# Altium schematic sheet power.SchDoc: schematic template
size 420 x 297 mm; Date: 2021-12-08; Author: Joachim Löfwander; Revision: ABC-123; SheetNumber: 2; SheetTotal: 4; Website: jlofw.com
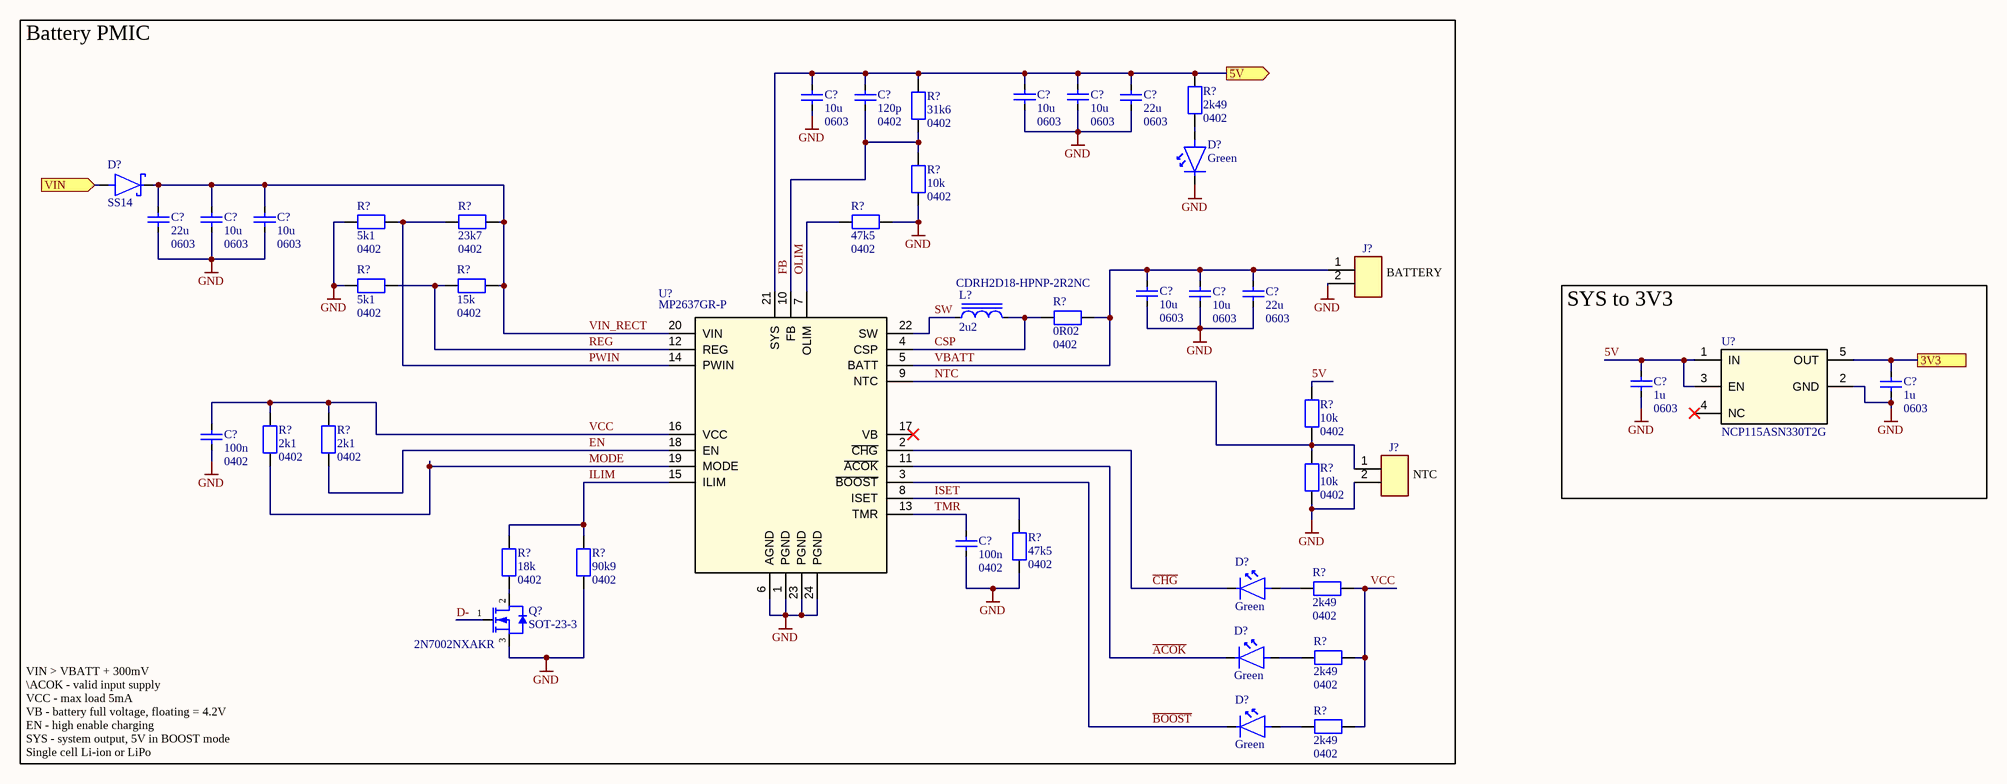
[diagram p0: power.SchDoc]

## Parts
(Parts that share a designator on the sheet are numbered #1, #2 ... from top to bottom, then left to right.)
C?#1  value 10u  Package: 0603  [C_0603_1608Metric_IPCB]  (hidden comment: Capacitor_Ceramic)
C?#2  value 120p  Package: 0402  [C_0402_1005Metric_IPCB]  (hidden comment: Capacitor_Ceramic)
C?#3  value 10u  Package: 0603  [C_0603_1608Metric_IPCB]  (hidden comment: Capacitor_Ceramic)
C?#4  value 10u  Package: 0603  [C_0603_1608Metric_IPCB]  (hidden comment: Capacitor_Ceramic)
C?#5  value 22u  Package: 0603  [C_0603_1608Metric_IPCB]  (hidden comment: Capacitor_Ceramic)
C?#6  value 22u  Package: 0603  [C_0603_1608Metric_IPCB]  (hidden comment: Capacitor_Ceramic)
C?#7  value 10u  Package: 0603  [C_0603_1608Metric_IPCB]  (hidden comment: Capacitor_Ceramic)
C?#8  value 10u  Package: 0603  [C_0603_1608Metric_IPCB]  (hidden comment: Capacitor_Ceramic)
C?#9  value 10u  Package: 0603  [C_0603_1608Metric_IPCB]  (hidden comment: Capacitor_Ceramic)
C?#10  value 10u  Package: 0603  [C_0603_1608Metric_IPCB]  (hidden comment: Capacitor_Ceramic)
C?#11  value 22u  Package: 0603  [C_0603_1608Metric_IPCB]  (hidden comment: Capacitor_Ceramic)
C?#12  value 1u  Package: 0603  [C_0603_1608Metric_IPCB]  (hidden comment: Capacitor_Ceramic)
C?#13  value 1u  Package: 0603  [C_0603_1608Metric_IPCB]  (hidden comment: Capacitor_Ceramic)
C?#14  value 100n  Package: 0402  [C_0402_1005Metric_IPCB]  (hidden comment: Capacitor_Ceramic)
C?#15  value 100n  Package: 0402  [C_0402_1005Metric_IPCB]  (hidden comment: Capacitor_Ceramic)
D?#1  value Green  [LED_0402]  (hidden comment: Diode_LED)
D?#2  Manufacturer P/N: SS14  [D_SMA_IPCB]  (hidden comment: Diode_Schottky)
D?#3  value Green  [LED_0402]  (hidden comment: Diode_LED)
D?#4  value Green  [LED_0402]  (hidden comment: Diode_LED)
D?#5  value Green  [LED_0402]  (hidden comment: Diode_LED)
J?#1  Conn_01x02  [PinHeader_1x02_P2.54mm_Vertical]  (value not drawn)
J?#2  Conn_01x02  [PinHeader_1x02_P2.54mm_Vertical]  (value not drawn)
L?  value 2u2  Manufacturer P/N: CDRH2D18-HPNP-2R2NC  [Sumida_CDRH2D18-HPNP-2R2NC]  (hidden comment: Inductor)
Q?  Package: SOT-23-3  Manufacturer P/N: 2N7002NXAKR  [SOT23-3_Standard_IPCB]  (hidden comment: NMOS_GDS)
R?#1  value 2k49  Package: 0402  [R_0402_1005Metric_IPCB]  (hidden comment: Resistor)
R?#2  value 31k6  Package: 0402  [R_0402_1005Metric_IPCB]  (hidden comment: Resistor)
R?#3  value 10k  Package: 0402  [R_0402_1005Metric_IPCB]  (hidden comment: Resistor)
R?#4  value 5k1  Package: 0402  [R_0402_1005Metric_IPCB]  (hidden comment: Resistor)
R?#5  value 23k7  Package: 0402  [R_0402_1005Metric_IPCB]  (hidden comment: Resistor)
R?#6  value 47k5  Package: 0402  [R_0402_1005Metric_IPCB]  (hidden comment: Resistor)
R?#7  value 5k1  Package: 0402  [R_0402_1005Metric_IPCB]  (hidden comment: Resistor)
R?#8  value 15k  Package: 0402  [R_0402_1005Metric_IPCB]  (hidden comment: Resistor)
R?#9  value 0R02  Package: 0402  [R_0402_1005Metric_IPCB]  (hidden comment: Resistor)
R?#10  value 10k  Package: 0402  [R_0402_1005Metric_IPCB]  (hidden comment: Resistor)
R?#11  value 2k1  Package: 0402  [R_0402_1005Metric_IPCB]  (hidden comment: Resistor)
R?#12  value 2k1  Package: 0402  [R_0402_1005Metric_IPCB]  (hidden comment: Resistor)
R?#13  value 10k  Package: 0402  [R_0402_1005Metric_IPCB]  (hidden comment: Resistor)
R?#14  value 47k5  Package: 0402  [R_0402_1005Metric_IPCB]  (hidden comment: Resistor)
R?#15  value 18k  Package: 0402  [R_0402_1005Metric_IPCB]  (hidden comment: Resistor)
R?#16  value 90k9  Package: 0402  [R_0402_1005Metric_IPCB]  (hidden comment: Resistor)
R?#17  value 2k49  Package: 0402  [R_0402_1005Metric_IPCB]  (hidden comment: Resistor)
R?#18  value 2k49  Package: 0402  [R_0402_1005Metric_IPCB]  (hidden comment: Resistor)
R?#19  value 2k49  Package: 0402  [R_0402_1005Metric_IPCB]  (hidden comment: Resistor)
U?#1  NCP115ASN330T2G  [NCP115ASN330T2G]
U?#2  Manufacturer P/N: MP2637GR-P  [MP2637GR]  (hidden comment: MP2637GR)

## Blocks framed on the sheet
Battery PMIC: C?#1-C?#11 C?#14 C?#15 D?#1-D?#5 J?#1 J?#2 L? Q? R?#1-R?#19 U?#2
SYS to 3V3: C?#12 C?#13 U?#1

## Ports
3V3, 5V (out), VIN (in)

## Nets
GND: C?#1.1 C?#3.1 C?#4.1 C?#5.1 C?#6.1 C?#7.1 C?#8.1 C?#9.1 C?#10.1 C?#11.1 C?#12.1 C?#13.1 C?#14.1 C?#15.1 D?#1.1(C) J?#1.2 J?#2.2 Q?.3(SOURCE) R?#3.1 R?#4.1 R?#6.2 R?#7.1 R?#13.1 R?#14.1 R?#16.1 U?#1.2(GND) U?#2.1(PGND) U?#2.6(AGND) U?#2.23(PGND) U?#2.24(PGND)
3V3: C?#13.2 U?#1.5(OUT) ; port 3V3
5V: C?#1.2 C?#2.2 C?#3.2 C?#4.2 C?#5.2 R?#1.2 R?#2.2 U?#2.21(SYS) ; port 5V
5V: C?#12.2 R?#10.2 U?#1.1(IN) U?#1.3(EN)  [a separate net that carries the same name]
~{ACOK}: D?#4.1(C) U?#2.11(~{ACOK})
~{BOOST}: D?#5.1(C) U?#2.3(~{BOOST})
~{CHG}: D?#3.1(C) U?#2.2(~{CHG})
CSP: L?.2 R?#9.1 U?#2.4(CSP)
D-: Q?.1(GATE)
EN: R?#12.1 U?#2.18(EN)
FB: C?#2.1 R?#2.1 R?#3.2 U?#2.10(FB)
ILIM: R?#15.2 R?#16.2 U?#2.15(ILIM)
ISET: R?#14.2 U?#2.8(ISET)
MODE: R?#11.1 U?#2.19(MODE)
NTC: J?#2.1 R?#10.1 R?#13.2 U?#2.9(NTC)
OLIM: R?#6.1 U?#2.7(OLIM)
PWIN: R?#4.2 R?#5.1 U?#2.14(PWIN)
REG: R?#7.2 R?#8.1 U?#2.12(REG)
SW: L?.1 U?#2.22(SW)
TMR: C?#15.2 U?#2.13(TMR)
VBATT: C?#9.2 C?#10.2 C?#11.2 J?#1.1 R?#9.2 U?#2.5(BATT)
VCC: C?#14.2 R?#11.2 R?#12.2 R?#17.2 R?#18.2 R?#19.2 U?#2.16(VCC)
VIN: D?#2.2(A) ; port VIN
VIN_RECT: C?#6.2 C?#7.2 C?#8.2 D?#2.1(C) R?#5.2 R?#8.2 U?#2.20(VIN)
NetD?#1_2: D?#1.2(A) R?#1.1
NetD?#3_2: D?#3.2(A) R?#17.1
NetD?#4_2: D?#4.2(A) R?#18.1
NetD?#5_2: D?#5.2(A) R?#19.1
NetQ?_2: Q?.2(DRAIN) R?#15.1

Not connected (* = marked no-connect by the designer): U?#1 4(NC)*; U?#2 17(VB)*

## Notes on the sheet
- (near J?#1) BATTERY
- (near J?#2) NTC
- VIN > VBATT + 300mV
  \ACOK - valid input supply
  VCC - max load 5mA
  VB - battery full voltage, floating = 4.2V
  EN - high enable charging
  SYS - system output, 5V in BOOST mode
  Single cell Li-ion or LiPo
- PROJECT
- TITLE
- FILE NAME
- DATE MODIFIED
- SHEET
- REV
- OF
- AUTHOR
- WEBSITE

## Library data of the parts
C?#1 C?#3 C?#4 C?#7-C?#10 = 20014: 16V 10u 0603 X5R; Internal Number: 20014
C?#2 = 20015: 50V 120p 0402 X7R; Internal Number: 20015
C?#5 C?#6 C?#11 = 20013: 16V 22u 0603 X5R; Internal Number: 20013
C?#12 C?#13 = 20016: 16V 1u 0603 X7R; Internal Number: 20016
C?#14 C?#15 = 20002: 50V 100n 0402 X7R; Internal Number: 20002
D?#1 D?#3-D?#5 = 40002: LED 0402 Green; Internal Number: 40002; Package: 0402
D?#2 = 40006: Schottky 40 V 1A SMA; Manufacturer: onsemi; Internal Number: 40006; Package: SMA
J?#1 J?#2 = 110001: 01x02 P2.54 PinHeader; Internal Number: 110001
L? = 190001: Inductor 2.2uH 1.6A 60mOhm; Manufacturer: Sumida; Internal Number: 190001
Q? = 60001: 60V 300mA NMOS SOT-23-3; Manufacturer: Nexperia; Internal Number: 60001
R?#1 R?#17-R?#19 = 10021: 0402 2k49 1%; Internal Number: 10021
R?#2 = 10023: 0402 31k6 1%; Internal Number: 10023
R?#3 R?#10 R?#13 = 10033: 0402 10k 1%; Internal Number: 10033
R?#4 R?#7 = 10029: 0402 5k1 1%; Internal Number: 10029
R?#5 = 10017: 0402 23k7 1%; Internal Number: 10017
R?#6 R?#14 = 10034: 0402 47k5 1%; Internal Number: 10034
R?#8 = 10006: 0402 15k 1%; Internal Number: 10006
R?#9 = 10001: 0402 0R02 1%; Internal Number: 10001
R?#11 R?#12 = 10019: 0402 2k1 1%; Internal Number: 10019
R?#15 = 10008: 0402 18k 1%; Internal Number: 10008
R?#16 = 10032: 0402 90k9 1%; Internal Number: 10032
U?#1 = 80001: 3V3 LDO 300mA; Manufacturer: onsemi; Internal Number: 80001; Manufacturer P/N: NCP115ASN330T2G; Package: TSOP5
U?#2 = 180003: MP2637GR Li-ion charger; Manufacturer: Monolithic Power Systems; Internal Number: 180003; Package: QFN